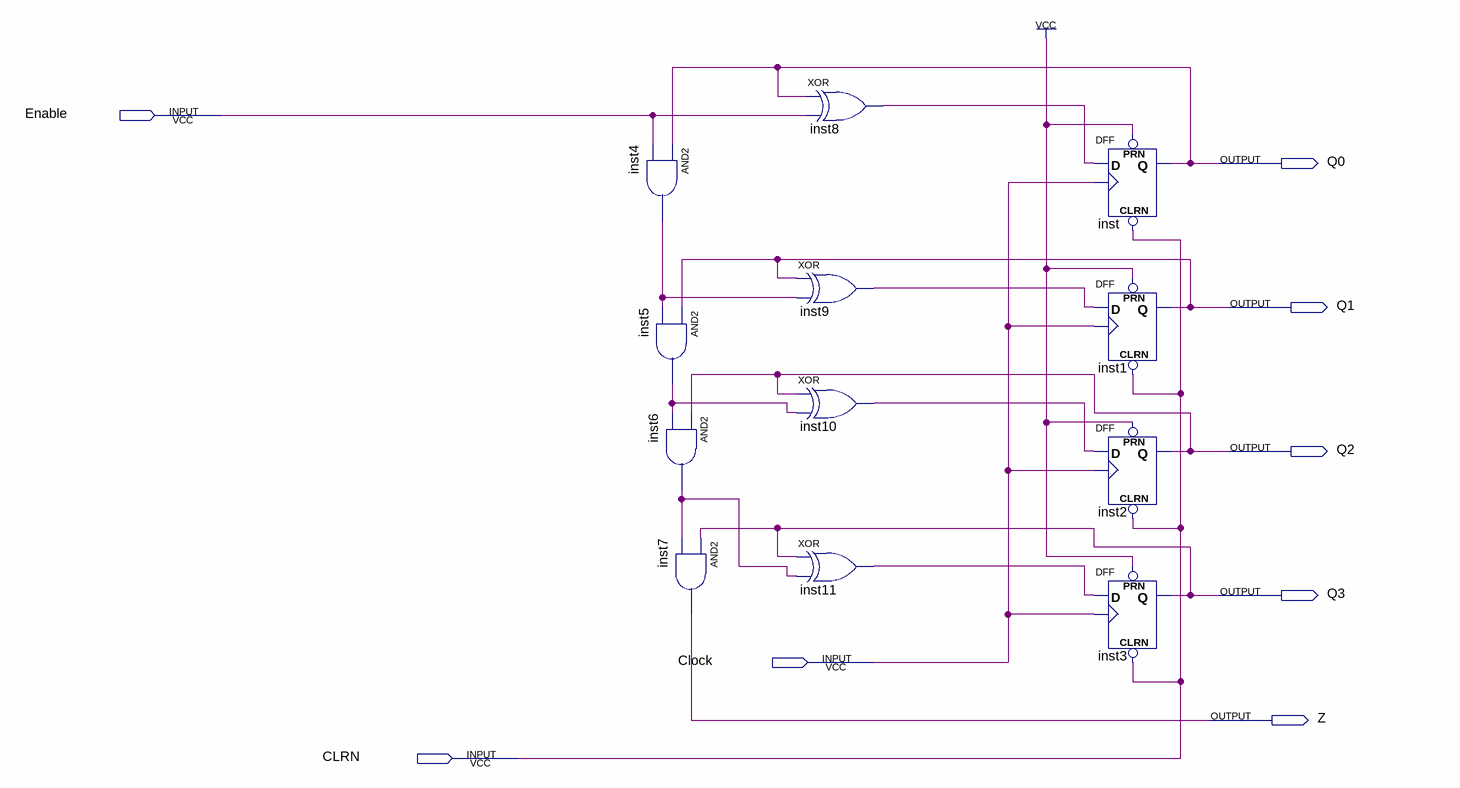
[diagram p0: schematic sheet]
// Quartus schematic lab10step2a.bdf as structural Verilog: 12 symbols, 8 pins
module lab10step2a (
  input  Enable,
  input  Clock,
  input  CLRN,
  output Q0,
  output Q1,
  output Q2,
  output Q3,
  output Z
);

  wire inst4_out, inst5_out, inst6_out, inst8_out, inst9_out, inst10_out, inst11_out;

  and inst4 (inst4_out, Q0, Enable);
  and inst5 (inst5_out, Q1, inst4_out);
  and inst6 (inst6_out, Q2, inst5_out);
  and inst7 (Z, Q3, inst6_out);
  xor inst8 (inst8_out, Q0, Enable);
  xor inst9 (inst9_out, Q1, inst4_out);
  xor inst10 (inst10_out, Q2, inst5_out);
  xor inst11 (inst11_out, Q3, inst6_out);
  DFF inst (.CLRN(CLRN), .CLK(Clock), .D(inst8_out), .PRN(1'b1), .Q(Q0));
  DFF inst1 (.CLRN(CLRN), .CLK(Clock), .D(inst9_out), .PRN(1'b1), .Q(Q1));
  DFF inst2 (.CLRN(CLRN), .CLK(Clock), .D(inst10_out), .PRN(1'b1), .Q(Q2));
  DFF inst3 (.CLRN(CLRN), .CLK(Clock), .D(inst11_out), .PRN(1'b1), .Q(Q3));
endmodule
